# Altium schematic sheet MainBoard_MCU_PWR.SchDoc
size B
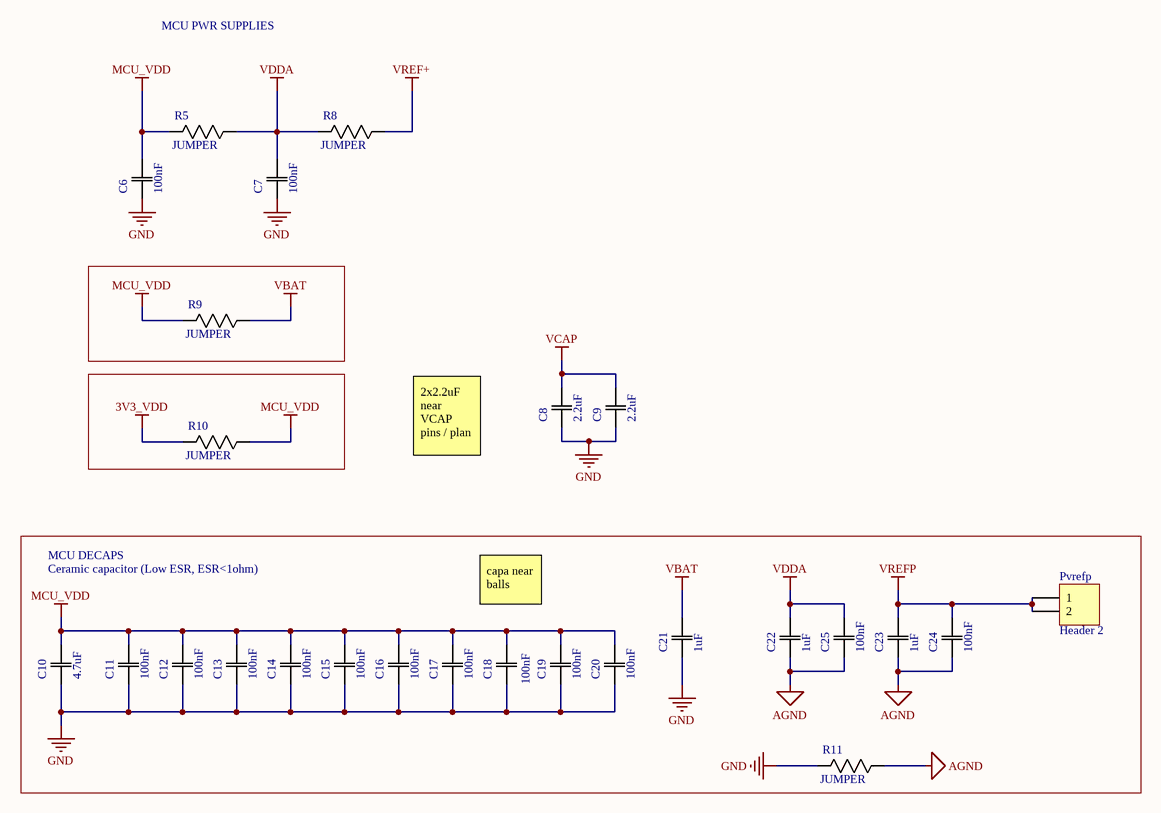
[diagram p0: MainBoard_MCU_PWR.SchDoc]

## Parts
C6  100nF  [0805]
C7  100nF  [0805]
C8  2.2uF  [0805]
C9  2.2uF  [0805]
C10  4.7uF  [0805]
C11  100nF  [0805]
C12  100nF  [0805]
C13  100nF  [0805]
C14  100nF  [0805]
C15  100nF  [0805]
C16  100nF  [0805]
C17  100nF  [0805]
C18  100nF  [0805]
C19  100nF  [0805]
C20  100nF  [0805]
C21  1uF  [0805]
C22  1uF  [0805]
C23  1uF  [0805]
C24  100nF  [0805]
C25  100nF  [0805]
Pvrefp  Header 2  [HDR1X2]
R5  JUMPER  [0805]
R8  JUMPER  [0805]
R9  JUMPER  [0805]
R10  JUMPER  [0805]
R11  JUMPER  [0805]

## Nets
3V3_VDD: R10.2(R2)
AGND: C22.1(C1) C23.1(C1) C24.1(C1) C25.1(C1) R11.1(R1)
GND: C6.1(C1) C7.1(C1) C8.1(C1) C9.1(C1) C10.1(C1) C11.1(C1) C12.1(C1) C13.1(C1) C14.1(C1) C15.1(C1) C16.1(C1) C17.1(C1) C18.1(C1) C19.1(C1) C20.1(C1) C21.1(C1) R11.2(R2)
MCU_VDD: C6.2(C2) C10.2(C2) C11.2(C2) C12.2(C2) C13.2(C2) C14.2(C2) C15.2(C2) C16.2(C2) C17.2(C2) C18.2(C2) C19.2(C2) C20.2(C2) R5.2(R2) R9.2(R2) R10.1(R1)
VBAT: C21.2(C2) R9.1(R1)
VCAP: C8.2(C2) C9.2(C2)
VDDA: C7.2(C2) C22.2(C2) C25.2(C2) R5.1(R1) R8.2(R2)
VREF+: R8.1(R1)
VREFP: C23.2(C2) C24.2(C2) Pvrefp.1 Pvrefp.2

## Notes on the sheet
- MCU PWR SUPPLIES
- 2x2.2uF near VCAP pins / plan
- MCU DECAPS
- Ceramic capacitor (Low ESR, ESR<1ohm)
- capa near balls

## Library data of the parts
C6 C7 C11-C20 C24 C25 = CAP 100nF 0805: CAP CER 0.1UF 50V X7R 0805; MP: CC0805KRX7R9BB104; MF: Yageo; Tolerance: 10%; Package: 0805; Price: 0,119 CAD; Value: 100nF; Digikey: 311-1140-1-ND; Digikey Link: https://www.digikey.ca/products/en?keywords=311-1140-1-ND; Rating: 50V
C8 C9 = CAP 2.2uF 0805: CAP CER 1UF 50V X7R 0805; MP: C0805C225K4RACTU; MF: KEMET; Tolerance: 10%; Rating: 16V; Package: 0805; Price: 0,461 CAD; Value: 2.2uF; Digikey: 399-3523-1-ND; Digikey Link: https://www.digikey.ca/products/en?keywords=399-3523-1-ND
C10 = CAP 4.7uF 0805: CAP CER 4.7UF 25V X5R 0805; MP: CL21B475KOFNNNE; MF: Samsung Electro-Mechanics; Tolerance: 10%; Rating: 16V; Temperature Coefficient: X7R; Package: 0805; Price: 0,49 CAD; Value: 4.7uF; Digikey: 1276-2873-1-ND; Digikey Link: https://www.digikey.ca/product-detail/en/samsung-electro-mechanics/CL21B475KOFNNNE/1276-2873-1-ND/3890959
C21-C23 = CAP 1uF 0805: CAP CER 1UF 50V X7R 0805; MP: CL21B105KBFNNNE; MF: Samsung Electro-Mechanics; Tolerance: 10%; Package: 0805; Price: 0,172 CAD; Value: 1uF; Digikey: 1276-1029-1-ND; Digikey Link: https://www.digikey.ca/product-detail/en/samsung-electro-mechanics/CL21B105KBFNNNE/1276-1029-1-ND/3889115; Rating: 50V
Pvrefp = Header 2: Header, 2-Pin; LatestRevisionDate: 17-Jul-2002; LatestRevisionNote: Re-released for DXP Platform.; Publisher: Altium Limited
R5 R8-R11 = RES 0 0805: RES SMD 0 OHM JUMPER 1/8W 0805; MP: RC0805JR-070RL; MF: Yageo; Value: 0; Rating: 0.125W; Digikey: 311-0.0ARCT-ND; Price: 0.058 CAD; Package: 0805; Digikey Link: https://www.digikey.ca/products/en?keywords=311-0.0ARCT-ND